# EAGLE schematic gyro_motherboard (EAGLE 5.11)
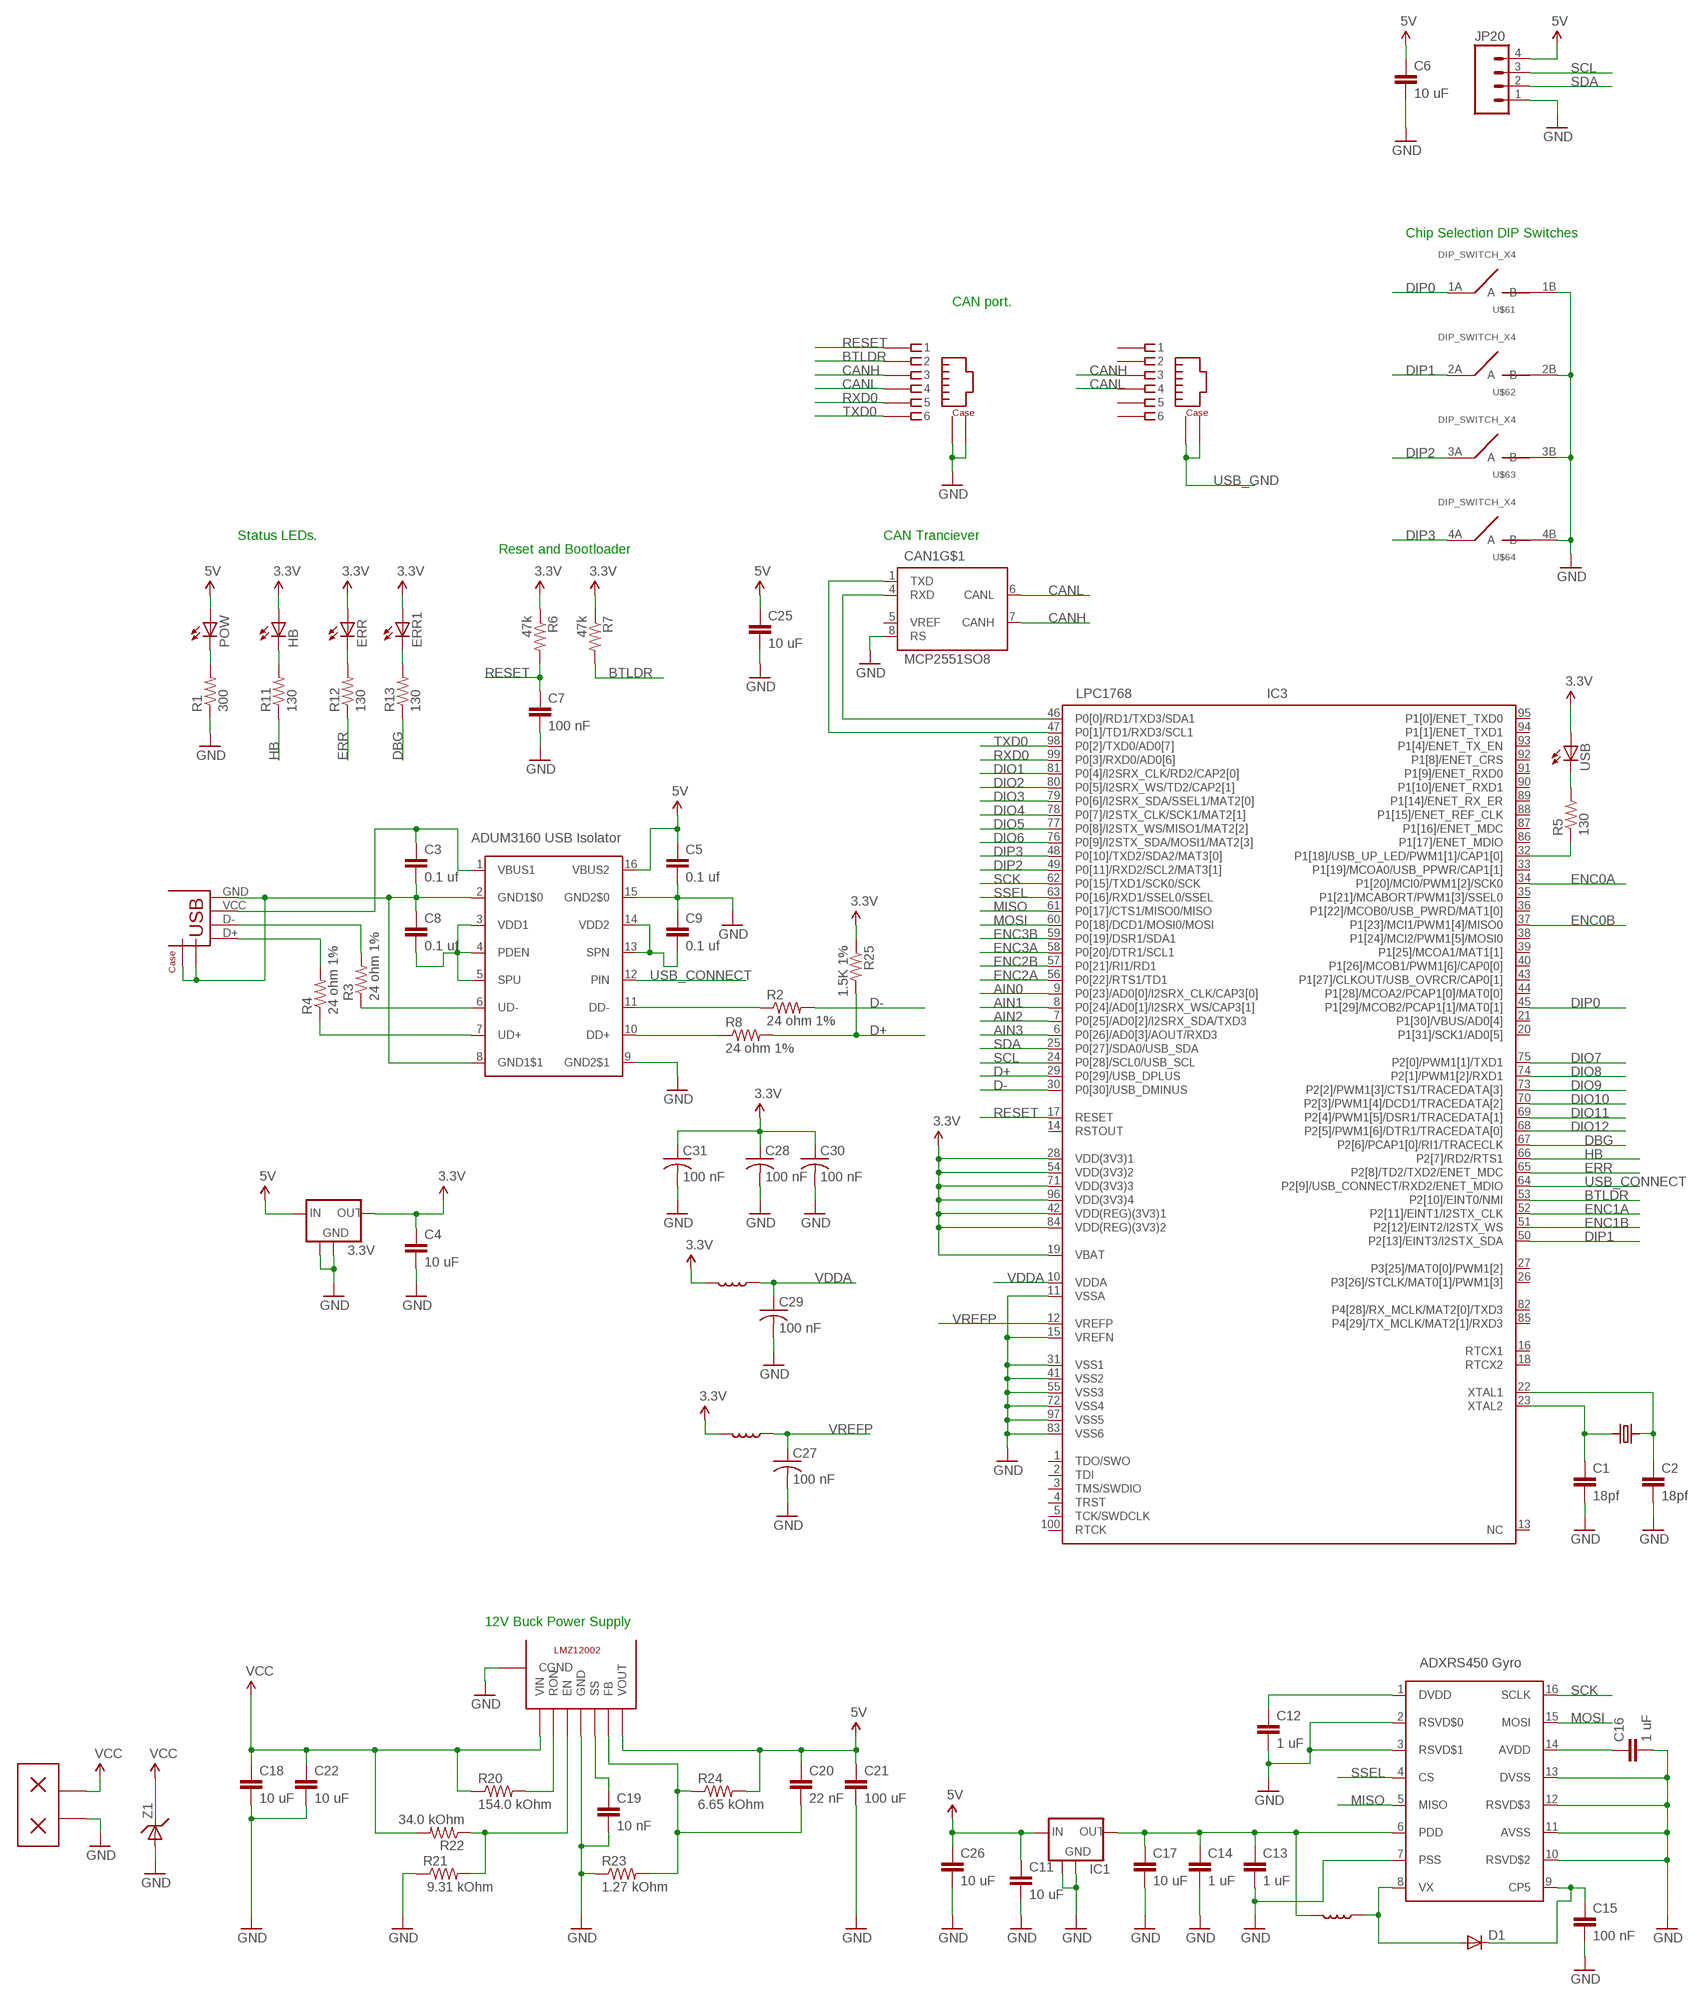
[diagram p0: schematic, sheet 1, part 1 of 2]
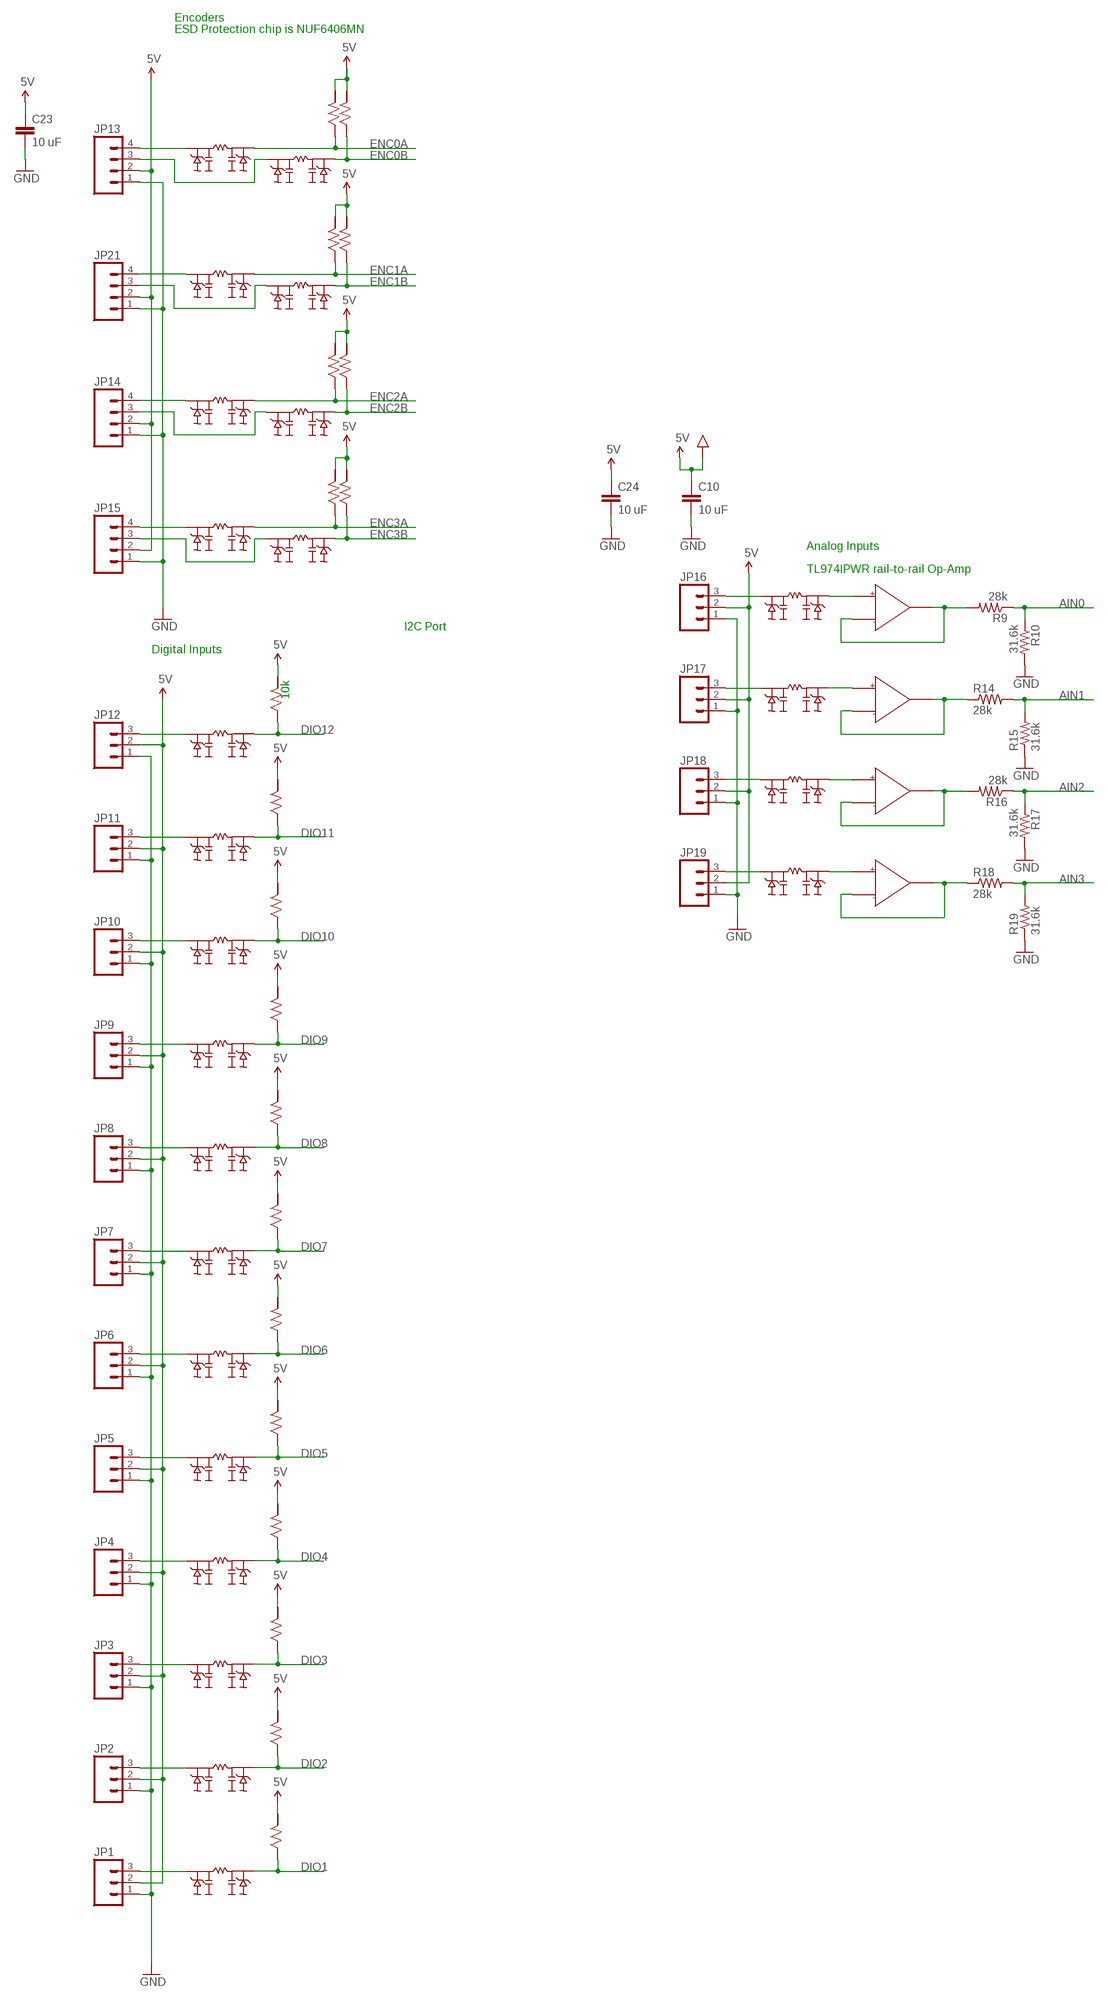
[diagram p1: schematic, sheet 1, part 2 of 2]

## Parts
3.3V  V_REG_TC1262  [SOT223]
C1  18pf  CAP0805  [0805]
C2  18pf  CAP0805  [0805]
C3  0.1 uf  CAP0603-CAP  [0603-CAP]
C4  10 uF  CAP0805  [0805]
C5  0.1 uf  CAP0603-CAP  [0603-CAP]
C6  10 uF  CAP0805  [0805]
C7  100 nF  CAP0805  [0805]
C8  0.1 uf  CAP0603-CAP  [0603-CAP]
C9  0.1 uf  CAP0603-CAP  [0603-CAP]
C10  10 uF  CAP0805  [0805]
C11  10 uF  CAP0805  [0805]
C12  1 uF  CAP0603-CAP  [0603-CAP]
C13  1 uF  CAP0603-CAP  [0603-CAP]
C14  1 uF  CAP0603-CAP  [0603-CAP]
C15  100 nF  CAP0603-CAP  [0603-CAP]
C16  1 uF  CAP0603-CAP  [0603-CAP]
C17  10 uF  CAP0805  [0805]
C18  10 uF  CAP1210  [1210]
C19  10 nF  CAP0805  [0805]
C20  22 nF  CAP0805  [0805]
C21  100 uF  CAP1210  [1210]
C22  10 uF  CAP1210  [1210]
C23  10 uF  CAP0805  [0805]
C24  10 uF  CAP0805  [0805]
C25  10 uF  CAP0805  [0805]
C26  10 uF  CAP0805  [0805]
C27  100 nF  C-USC0402  [C0402]
C28  100 nF  C-USC0402  [C0402]
C29  100 nF  C-USC0402  [C0402]
C30  100 nF  C-USC0402  [C0402]
C31  100 nF  C-USC0402  [C0402]
CAN1  MCP2551SO8  [SO08]
D1  DIODESOT23  [SOT23-3]
ERR  LEDCHIPLED_0805  [CHIPLED_0805]
ERR1  LEDCHIPLED_0805  [CHIPLED_0805]
HB  LEDCHIPLED_0805  [CHIPLED_0805]
IC1  V_REG_TC1262  [SOT223]
IC3  LPC1768  [LQFP100-14X14]
JP1  M03PTH  [1X03]
JP2  M03PTH  [1X03]
JP3  M03PTH  [1X03]
JP4  M03PTH  [1X03]
JP5  M03PTH  [1X03]
JP6  M03PTH  [1X03]
JP7  M03PTH  [1X03]
JP8  M03PTH  [1X03]
JP9  M03PTH  [1X03]
JP10  M03PTH  [1X03]
JP11  M03PTH  [1X03]
JP12  M03PTH  [1X03]
JP13  M041X04_NO_SILK  [1X04_NO_SILK]
JP14  M041X04_NO_SILK  [1X04_NO_SILK]
JP15  M041X04_NO_SILK  [1X04_NO_SILK]
JP16  M03PTH  [1X03]
JP17  M03PTH  [1X03]
JP18  M03PTH  [1X03]
JP19  M03PTH  [1X03]
JP20  M041X04_NO_SILK  [1X04_NO_SILK]
JP21  M041X04_NO_SILK  [1X04_NO_SILK]
POW  LEDCHIPLED_0805  [CHIPLED_0805]
R1  300  RESISTOR0603-RES  [0603-RES]
R2  24 ohm 1%  RESISTOR0603-RES  [0603-RES]
R3  24 ohm 1%  RESISTOR0603-RES  [0603-RES]
R4  24 ohm 1%  RESISTOR0603-RES  [0603-RES]
R5  130  RESISTOR0603-RES  [0603-RES]
R6  47k  RESISTOR0603-RES  [0603-RES]
R7  47k  RESISTOR0603-RES  [0603-RES]
R8  24 ohm 1%  RESISTOR0603-RES  [0603-RES]
R9  28k  RESISTOR0603-RES  [0603-RES]
R10  31.6k  RESISTOR0603-RES  [0603-RES]
R11  130  RESISTOR0603-RES  [0603-RES]
R12  130  RESISTOR0603-RES  [0603-RES]
R13  130  RESISTOR0603-RES  [0603-RES]
R14  28k  RESISTOR0603-RES  [0603-RES]
R15  31.6k  RESISTOR0603-RES  [0603-RES]
R16  28k  RESISTOR0603-RES  [0603-RES]
R17  31.6k  RESISTOR0603-RES  [0603-RES]
R18  28k  RESISTOR0603-RES  [0603-RES]
R19  31.6k  RESISTOR0603-RES  [0603-RES]
R20  154.0 kOhm  RESISTOR0805-RES  [0805]
R21  9.31 kOhm  RESISTOR0805-RES  [0805]
R22  34.0 kOhm  RESISTOR0805-RES  [0805]
R23  1.27 kOhm  RESISTOR0805-RES  [0805]
R24  6.65 kOhm  RESISTOR0805-RES  [0805]
R25  1.5K 1%  RESISTOR0805-RES  [0805]
U$2  CRYSTAL  [CRYSTAL]
U$4  ADUM3160  [SOIC_W]
U$5  ADXRS450  [SOIC_CAV]
U$6  DIP_SWITCH_X4  [219-4LPST]
U$8  RJ16  [85510-5019]
U$9  USB  [M701-330442]
U$10  RJ16  [85510-5019]
U$13  NUF6406M  [DFN12]
U$14  NUF6406M  [DFN12]
U$15  NUF6406M  [DFN12]
U$16  TL974IPWR  TL974IPWRTL974IPWR  [TSSOP-14]
U$19  NUF6406M  [DFN12]
U$21  WA06X103JTL  [0603X4]
U$22  WA06X103JTL  [0603X4]
U$23  WA06X103JTL  [0603X4]
U$36  LQH43MN471J03L  [L1812]
U$39  LMZ12002  [TZA07A]
U$43  39543-020239  [39543-0202]
U$44  NUF6406M  [DFN12]
U$45  WA06X103JTL  [0603X4]
U$46  WA06X103JTL  [0603X4]
U$52  1608_INDUCTOR  [L1608]
U$53  1608_INDUCTOR  [L1608]
USB  LEDCHIPLED_0805  [CHIPLED_0805]
Z1  MMSZ5242BT1G  [SOD-123]

## Nets
3.3V: 3.3V.3(OUT) C4.1 C28.1 C30.1 C31.1 ERR1.A ERR.A HB.A IC3.19(VBAT) IC3.28(VDD(3V3)1) IC3.42(VDD(REG)(3V3)1) IC3.54(VDD(3V3)2) IC3.71(VDD(3V3)3) IC3.84(VDD(REG)(3V3)2) IC3.96(VDD(3V3)4) R6.1 R7.1 R25.1 U$52.P$2 U$53.P$2 USB.A
5V: 3.3V.1(IN) C5.1 C6.1 C10.1 C11.1 C20.1 C21.1 C23.1 C24.1 C25.1 C26.1 IC1.1(IN) JP1.2 JP2.2 JP3.2 JP4.2 JP5.2 JP6.2 JP7.2 JP8.2 JP9.2 JP10.2 JP11.2 JP12.2 JP13.2 JP14.2 JP15.2 JP16.2 JP17.2 JP18.2 JP19.2 JP20.4 JP21.2 POW.A R24.2 U$4.16(VBUS2) U$16.P4(V+) U$21.P5(R2) U$21.P6(R2) U$21.P7(R2) U$21.P8(R2) U$22.P5(R2) U$22.P6(R2) U$22.P7(R2) U$22.P8(R2) U$23.P5(R2) U$23.P6(R2) U$23.P7(R2) U$23.P8(R2) U$39.P7(VOUT) U$45.P5(R2) U$45.P6(R2) U$45.P7(R2) U$45.P8(R2) U$46.P5(R2) U$46.P6(R2) U$46.P7(R2) U$46.P8(R2)
AIN0: IC3.9(P0[23]/AD0[0]/I2SRX_CLK/CAP3[0]) R9.1 R10.1
AIN1: IC3.8(P0[24]/AD0[1]/I2SRX_WS/CAP3[1]) R14.2 R15.2
AIN2: IC3.7(P0[25]/AD0[2]/I2SRX_SDA/TXD3) R16.1 R17.1
AIN3: IC3.6(P0[26]/AD0[3]/AOUT/RXD3) R18.2 R19.2
BTLDR: IC3.53(P2[10]/EINT0/NMI) R7.2 U$8.2
CANH: CAN1.7(CANH) U$8.3 U$10.3
CANL: CAN1.6(CANL) U$8.4 U$10.4
D+: IC3.29(P0[29]/USB_DPLUS) R8.2 R25.2
D-: IC3.30(P0[30]/USB_DMINUS) R2.2
DBG: IC3.67(P2[6]/PCAP1[0]/RI1/TRACECLK) R13.1
DIO1: IC3.81(P0[4]/I2SRX_CLK/RD2/CAP2[0]) U$14.12 U$23.P1(R1)
DIO2: IC3.80(P0[5]/I2SRX_WS/TD2/CAP2[1]) U$14.11 U$23.P2(R1)
DIO3: IC3.79(P0[6]/I2SRX_SDA/SSEL1/MAT2[0]) U$14.10 U$23.P3(R1)
DIO4: IC3.78(P0[7]/I2STX_CLK/SCK1/MAT2[1]) U$14.9 U$23.P4(R1)
DIO5: IC3.77(P0[8]/I2STX_WS/MISO1/MAT2[2]) U$14.8 U$22.P1(R1)
DIO6: IC3.76(P0[9]/I2STX_SDA/MOSI1/MAT2[3]) U$14.7 U$22.P2(R1)
DIO7: IC3.75(P2[0]/PWM1[1]/TXD1) U$13.12 U$22.P3(R1)
DIO8: IC3.74(P2[1]/PWM1[2]/RXD1) U$13.11 U$22.P4(R1)
DIO9: IC3.73(P2[2]/PWM1[3]/CTS1/TRACEDATA[3]) U$13.10 U$21.P1(R1)
DIO10: IC3.70(P2[3]/PWM1[4]/DCD1/TRACEDATA[2]) U$13.9 U$21.P2(R1)
DIO11: IC3.69(P2[4]/PWM1[5]/DSR1/TRACEDATA[1]) U$13.8 U$21.P3(R1)
DIO12: IC3.68(P2[5]/PWM1[6]/DTR1/TRACEDATA[0]) U$13.7 U$21.P4(R1)
DIP0: IC3.45(P1[29]/MCOB2/PCAP1[1]/MAT0[1]) U$6.1A(1:A)
DIP1: IC3.50(P2[13]/EINT3/I2STX_SDA) U$6.2A(2:A)
DIP2: IC3.49(P0[11]/RXD2/SCL2/MAT3[1]) U$6.3A(3:A)
DIP3: IC3.48(P0[10]/TXD2/SDA2/MAT3[0]) U$6.4A(4:A)
ENC0A: IC3.34(P1[20]/MCI0/PWM1[2]/SCK0) U$15.12 U$46.P1(R1)
ENC0B: IC3.37(P1[23]/MCI1/PWM1[4]/MISO0) U$15.11 U$46.P2(R1)
ENC1A: IC3.52(P2[11]/EINT1/I2STX_CLK) U$15.10 U$46.P3(R1)
ENC1B: IC3.51(P2[12]/EINT2/I2STX_WS) U$15.9 U$46.P4(R1)
ENC2A: IC3.56(P0[22]/RTS1/TD1) U$15.8 U$45.P1(R1)
ENC2B: IC3.57(P0[21]/RI1/RD1) U$15.7 U$45.P2(R1)
ENC3A: IC3.58(P0[20]/DTR1/SCL1) U$44.12 U$45.P3(R1)
ENC3B: IC3.59(P0[19]/DSR1/SDA1) U$44.9 U$45.P4(R1)
ERR: IC3.65(P2[8]/TD2/TXD2/ENET_MDC) R12.1
GND: 3.3V.2(GND$1) 3.3V.TAB(GND$0) C1.2 C2.2 C4.2 C5.2 C6.2 C7.2 C9.1 C10.2 C11.2 C12.2 C13.2 C14.2 C15.2 C16.2 C17.2 C18.2 C19.2 C21.2 C22.2 C23.2 C24.2 C25.2 C26.2 C27.2 C28.2 C29.2 C30.2 C31.2 CAN1.8(RS) IC1.2(GND$1) IC1.TAB(GND$0) IC3.11(VSSA) IC3.15(VREFN) IC3.31(VSS1) IC3.41(VSS2) IC3.55(VSS3) IC3.72(VSS4) IC3.83(VSS6) IC3.97(VSS5) JP1.1 JP2.1 JP3.1 JP4.1 JP5.1 JP6.1 JP7.1 JP8.1 JP9.1 JP10.1 JP11.1 JP12.1 JP13.1 JP14.1 JP15.1 JP16.1 JP17.1 JP18.1 JP19.1 JP20.1 JP21.1 R1.1 R10.2 R15.1 R17.2 R19.1 R21.1 R23.1 U$4.9(GND2$1) U$4.15(GND2$0) U$5.2(RSVD$0) U$5.3(RSVD$1) U$5.7(PSS) U$5.10(RSVD$2) U$5.11(AVSS) U$5.12(RSVD$3) U$5.13(DVSS) U$6.1B(1:B) U$6.2B(2:B) U$6.3B(3:B) U$6.4B(4:B) U$8.P$0 U$8.P$1 U$39.GND(CGND) U$39.P4(GND) U$43.P$2 Z1.ANODE(A)
HB: IC3.66(P2[7]/RD2/RTS1) R11.1
MISO: IC3.61(P0[17]/CTS1/MISO0/MISO) U$5.5(MISO)
MOSI: IC3.60(P0[18]/DCD1/MOSI0/MOSI) U$5.15(MOSI)
N$1: CAN1.1(TXD) IC3.47(P0[1]/TD1/RXD3/SCL1)
N$2: CAN1.4(RXD) IC3.46(P0[0]/RD1/TXD3/SDA1)
N$3: ERR1.C R13.2
N$4: C3.1 U$4.1(VBUS1) U$9.VCC(VBUS)
N$5: C8.2 U$4.3(VDD1) U$4.4(PDEN) U$4.5(SPU)
N$6: R8.1 U$4.10(DD+)
N$7: IC3.32(P1[18]/USB_UP_LED/PWM1[1]/CAP1[0]) R5.1
N$8: C1.1 IC3.23(XTAL2) U$2.P$2
N$9: C2.1 IC3.22(XTAL1) U$2.P$4
N$10: POW.C R1.2
N$11: R2.1 U$4.11(DD-)
N$12: R4.2 U$9.D+
N$13: R3.2 U$9.D-
N$14: R5.2 USB.C
N$15: R3.1 U$4.6(UD-)
N$16: R4.1 U$4.7(UD+)
N$17: JP12.3 U$13.6
N$18: JP11.3 U$13.5
N$19: ERR.C R12.2
N$20: C9.2 U$4.13(SPN) U$4.14(VDD2)
N$21: JP10.3 U$13.4
N$22: JP9.3 U$13.3
N$23: JP8.3 U$13.2
N$24: JP7.3 U$13.1
N$25: JP6.3 U$14.6
N$26: HB.C R11.2
N$27: JP5.3 U$14.5
N$28: JP4.3 U$14.4
N$29: JP3.3 U$14.3
N$30: JP2.3 U$14.2
N$31: JP1.3 U$14.1
N$32: R9.2 U$16.P6(-) U$16.P7(OUT)
N$33: R14.1 U$16.P1(OUT) U$16.P2(-)
N$34: R16.2 U$16.P13(-) U$16.P14(OUT)
N$35: C16.1 U$5.14(AVDD)
N$36: JP13.4 U$15.1
N$37: JP14.4 U$15.5
N$38: JP15.4 U$44.1
N$39: JP15.3 U$44.4
N$40: JP14.3 U$15.6
N$41: JP13.3 U$15.2
N$42: JP16.3 U$19.3
N$43: U$16.P5(+) U$19.10
N$44: D1.1(A) U$5.8(VX) U$36.1
N$46: U$16.P12(+) U$19.8
N$47: U$16.P3(+) U$19.9
N$48: JP17.3 U$19.4
N$49: JP19.3 U$19.6
N$50: U$16.P10(+) U$19.7
N$51: C12.1 U$5.1(DVDD)
N$52: C19.1 U$39.P5(SS)
N$53: JP18.3 U$19.5
N$54: C13.1 C14.1 C17.1 IC1.3(OUT) U$5.6(PDD) U$36.2
N$55: R18.1 U$16.P8(OUT) U$16.P9(-)
N$56: C15.1 D1.3(C) U$5.9(CP5)
N$57: JP21.4 U$15.3
N$58: R20.2 U$39.P2(RON)
N$59: C20.2 R23.2 R24.1 U$39.P6(FB)
N$60: JP21.3 U$15.4
N$63: R21.2 R22.1 U$39.P3(EN)
RESET: C7.1 IC3.17(RESET) R6.2 U$8.1
RXD0: IC3.99(P0[3]/RXD0/AD0[6]) U$8.5
SCK: IC3.62(P0[15]/TXD1/SCK0/SCK) U$5.16(SCLK)
SCL: IC3.24(P0[28]/SCL0/USB_SCL) JP20.3
SDA: IC3.25(P0[27]/SDA0/USB_SDA) JP20.2
SSEL: IC3.63(P0[16]/RXD1/SSEL0/SSEL) U$5.4(CS)
TXD0: IC3.98(P0[2]/TXD0/AD0[7]) U$8.6
USB_CONNECT: IC3.64(P2[9]/USB_CONNECT/RXD2/ENET_MDIO) U$4.12(PIN)
USB_GND: C3.2 C8.1 U$4.2(GND1$0) U$4.8(GND1$1) U$9.GND U$9.P$0(CASE1V) U$9.P$1(CASE2) U$10.P$0 U$10.P$1
VCC: C18.1 C22.1 R20.1 R22.2 U$39.P1(VIN) U$43.P$1 Z1.CATHODE(C)
VDDA: C29.1 IC3.10(VDDA) U$52.P$1
VREFP: C27.1 IC3.12(VREFP) U$53.P$1
Unconnected: CAN1.5(VREF) IC3.1(TDO/SWO) IC3.2(TDI) IC3.3(TMS/SWDIO) IC3.4(TRST) IC3.5(TCK/SWDCLK) IC3.13(NC) IC3.14(RSTOUT) IC3.16(RTCX1) IC3.18(RTCX2) IC3.20(P1[31]/SCK1/AD0[5]) IC3.21(P1[30]/VBUS/AD0[4]) IC3.26(P3[26]/STCLK/MAT0[1]/PWM1[3]) IC3.27(P3[25]/MAT0[0]/PWM1[2]) IC3.33(P1[19]/MCOA0/USB_PPWR/CAP1[1]) IC3.35(P1[21]/MCABORT/PWM1[3]/SSEL0) IC3.36(P1[22]/MCOB0/USB_PWRD/MAT1[0]) IC3.38(P1[24]/MCI2/PWM1[5]/MOSI0) IC3.39(P1[25]/MCOA1/MAT1[1]) IC3.40(P1[26]/MCOB1/PWM1[6]/CAP0[0]) IC3.43(P1[27]/CLKOUT/USB_OVRCR/CAP0[1]) IC3.44(P1[28]/MCOA2/PCAP1[0]/MAT0[0]) IC3.82(P4[28]/RX_MCLK/MAT2[0]/TXD3) IC3.85(P4[29]/TX_MCLK/MAT2[1]/RXD3) IC3.86(P1[17]/ENET_MDIO) IC3.87(P1[16]/ENET_MDC) IC3.88(P1[15]/ENET_REF_CLK) IC3.89(P1[14]/ENET_RX_ER) IC3.90(P1[10]/ENET_RXD1) IC3.91(P1[9]/ENET_RXD0) IC3.92(P1[8]/ENET_CRS) IC3.93(P1[4]/ENET_TX_EN) IC3.94(P1[1]/ENET_TXD1) IC3.95(P1[0]/ENET_TXD0) IC3.100(RTCK) U$10.1 U$10.2 U$10.5 U$10.6 U$19.1 U$19.2 U$19.11 U$19.12 U$44.2 U$44.3 U$44.5 U$44.6 U$44.7 U$44.8 U$44.10 U$44.11

## Notes on the sheet
- Encoders
- ESD Protection chip is NUF6406MN
- Chip Selection DIP Switches
- CAN port.
- Analog Inputs
- TL974IPWR rail-to-rail Op-Amp
- I2C Port
- Digital Inputs
- 10k
- Status LEDs. | CAN Tranciever
- Reset and Bootloader
- 12V Buck Power Supply

## Power pins joined to a net without a drawn wire
GND: CAN1.2(GND) U$13.GND(GND:GND) U$14.GND(GND:GND) U$15.GND(GND:GND) U$16.P11(GND) U$19.GND(GND:GND) U$44.GND(GND:GND)
VCC: CAN1.3(VCC)

## Library data of the parts
3.3V IC1 = custom_parts:V_REG_TC1262: Voltage Regulator data sheet at http://ww1.microchip.com/downloads/en/DeviceDoc/21373b.pdf
C1-C26 = SparkFun:CAP: Capacitor Standard 0603 ceramic capacitor, and 0.1" leaded capacitor.
C27-C31 = rcl:C-US: CAPACITOR, American symbol
CAN1 = can:MCP2551: CAN Tranceiver Microchip
D1 = SparkFun:DIODE: Diode These are standard reverse protection diodes and small signal diodes. SMA package can handle up to about 1A. SOD-323 can handle about 200mA. What the SOD-323 package when ordering, there are some mfgs out there that are 5-pin packages.
ERR ERR1 HB POW USB = led:LED: LED OSRAM: - CHIPLED LG R971, LG N971, LY N971, LG Q971, LY Q971, LO R971, LY R971 LH N974, LH R974 LS Q976, LO Q976, LY Q976 LO Q996 - Hyper CHIPLED LW Q18S LB Q993, LB Q99A, LB R99A - SideLED LS A670, LO A670, LY A670, LG A670, LP A670 LB A673, LV A673, LT A673, LW A673 LH A674 LY A675 LS A676, LA A676, LO A676, LY A676, LW A676 LS A679, LY A679, LG A679 - Hyper Micro SIDELED® LS Y876, LA Y876, LO Y876, LY Y876 LT Y87S - SmartLED LW L88C, LW L88S LB L89C, LB L89S, LG L890 LS L89K, LO L89K, LY L89K LS L896, LA L896, LO L896, LY L896 - TOPLED LS T670, LO T670, LY T670, LG T670, LP T670 LSG T670, LSP T670, LSY T670, LOP T670, LYG T670 LG T671, LOG T671, LSG T671 LB T673, LV T673, LT T673, LW T673 LH T674 LS T676, LA T676, LO T676, LY T676, LB T676, LH T676, LSB T676, LW T676 LB T67C, LV T67C, LT T67C, LS T67K, LO T67K, LY T67K, LW E67C LS E67B, LA E67B, LO E67B, LY E67B, LB E67C, LV E67C, LT E67C LW T67C LS T679, LY T679, LG T679 LS T770, LO T770, LY T770, LG T770, LP T770 LB T773, LV T773, LT T773, LW T773 LH T774 LS E675, LA E675, LY E675, LS T675 LS T776, LA T776, LO T776, LY T776, LB T776 LHGB T686 LT T68C, LB T68C - Hyper Mini TOPLED® LB M676 - Mini TOPLED Santana® LG M470 LS M47K, LO M47K, LY M47K Source: http://www.osram.convergy.de LUXEON: - LUMILED® LXK2-PW12-R00, LXK2-PW12-S00, LXK2-PW14-U00, LXK2-PW14-V00 LXK2-PM12-R00, LXK2-PM12-S00, LXK2-PM14-U00 LXK2-PE12-Q00, LXK2-PE12-R00, LXK2-PE12-S00, LXK2-PE14-T00, LXK2-PE14-U00 LXK2-PB12-K00, LXK2-PB12-L00, LXK2-PB12-M00, LXK2-PB14-N00, LXK2-PB14-P00, LXK2-PB14-Q00 LXK2-PR12-L00, LXK2-PR12-M00, LXK2-PR14-Q00, LXK2-PR14-R00 LXK2-PD12-Q00, LXK2-PD12-R00, LXK2-PD12-S00 LXK2-PH12-R00, LXK2-PH12-S00 LXK2-PL12-P00, LXK2-PL12-Q00, LXK2-PL12-R00 Source: www.luxeon.com KINGBRIGHT: KA-3528ASYC Source: www.kingbright.com
IC3 = lpc1xxx-v6:LPC1768: LPC1768 100 MHz 32-bit ARM Cortex-M3 based microcontroller featuring a high level of integration and low power consumption. 512 kB Flash, 64 kB SRAM, USB Device/Host/OTG, 2 CAN, DAC, Ethernet MarcVl - Datasheet available on www.nxp.com
JP1-JP12 JP16-JP19 = SparkFun:M03: Header 3 Standard 3-pin 0.1" header. Use with straight break away headers (SKU : PRT-00116), right angle break away headers (PRT-00553), swiss pins (PRT-00743), machine pins (PRT-00117), and female headers (PRT-00115). Molex polarized connector foot print use with SKU : PRT-08232 with associated crimp pins and housings.
JP13-JP15 JP20 JP21 = SparkFun:M04: Header 4 Standard 4-pin 0.1" header. Use with straight break away headers (SKU : PRT-00116), right angle break away headers (PRT-00553), swiss pins (PRT-00743), machine pins (PRT-00117), and female headers (PRT-00115). Molex polarized connector foot print use with SKU : PRT-08231 with associated crimp pins and housings. 1MM SMD Version SKU: PRT-10208
R1-R25 = SparkFun:RESISTOR: Resistor Basic schematic elements and footprints for 0603, 1206, and PTH resistors.
U$2 = MC33887:CRYSTAL
U$4 = custom_parts:ADUM3160: ADuM3160 usb digital isolator all information from http://www.analog.com/static/imported-files/data_sheets/ADuM3160.pdf
U$5 = custom_parts:ADXRS450: ADXRS450 gyroscope all information from http://www.analog.com/static/imported-files/data_sheets/ADXRS450.pdf
U$6 = custom_parts:DIP_SWITCH_X4: 4 position dip switch from http://www.mouser.com/ProductDetail/CTS-Electronic-Components/219-4LPST/?qs=sGAEpiMZZMv%2f%252b2JhlA6ysGbG22VYatTYq6uUsyqguGg%3d
U$8 U$10 = custom_parts:RJ16: rj16 connector (6 slots 6 connectors) from http://www.mouser.com/ProductDetail/Molex/85510-5019/?qs=sGAEpiMZZMvQhAhQbXdbBsK4oSVSRxQMQtyAf8Fqgr8%3d (drawings at http://www.molex.com/pdm_docs/sd/855105019_sd.pdf)
U$9 = custom_parts:USB: usb connector
U$13-U$15 U$19 U$44 = custom_parts:NUF6406M
U$16 = custom_parts:TL974IPWR: TI Rail to Rail Quad Op-Amp
U$21-U$23 U$45 U$46 = custom_parts:WA06X103JTL
U$36 = custom_parts:LQH43MN471J03L
U$39 = custom_parts:LMZ12002
U$43 = custom_parts:39543-0202: MOLEX 39543-0202 Terminal Block
U$52 U$53 = custom_parts:1608_INDUCTOR
Z1 = custom_parts:MMSZ5242BT1G: zener diode datasheet at http://www.onsemi.com/pub_link/Collateral/MMSZ5221BT1-D.PDF